# Altium project PCB_Project.PrjPcb
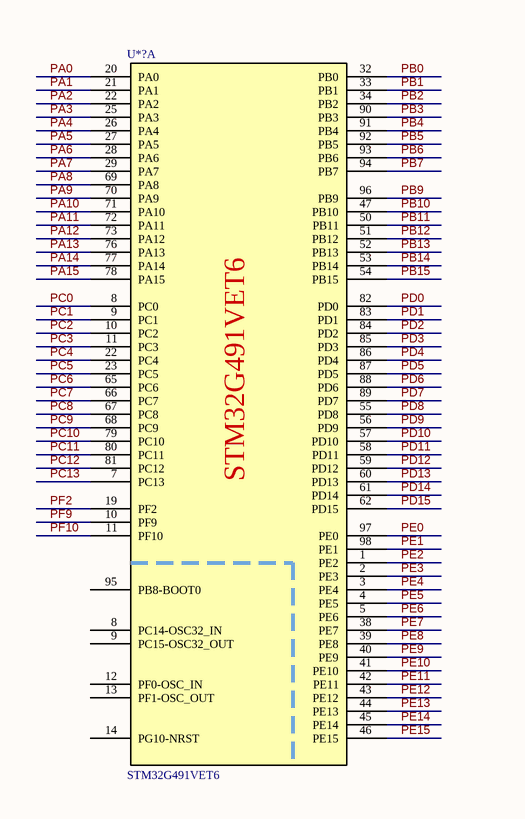
[diagram p0: Sheet1.SchDoc, left]
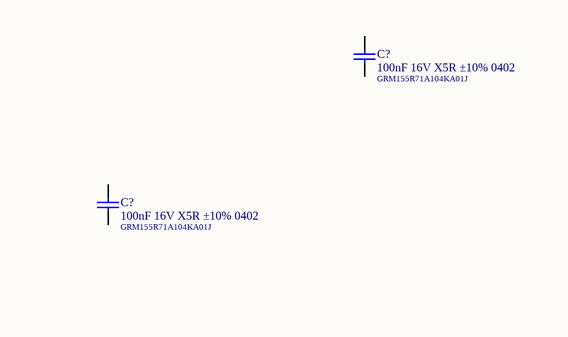
[diagram p1: Sheet1.SchDoc, right]
3 sheets, 15 parts. Net scope: global (net labels, ports and power ports of the same name join across sheets).
Board file: PCB1.PcbDoc
Sheets:
  Sheet1.SchDoc
  Sheet2.SchDoc
  Sheet3.SchDoc

## Sheet Sheet1.SchDoc
size A4; SheetNumber: 1; SheetTotal: 3

### Parts
(Parts that share a designator on the sheet are numbered #1, #2 ... from top to bottom, then left to right.)
C?#1  100nF 16V X5R ±10% 0402  Name: GRM155R71A104KA01J  [0402]
C?#2  100nF 16V X5R ±10% 0402  Name: GRM155R71A104KA01J  [0402]
U*?#1  STM32G491VET6  [QFP50P1600X1600X160-100N]  (part A of 2)

### Nets
PA0: U*?#1.20(PA0)
PA1: U*?#1.21(PA1)
PA2: U*?#1.22(PA2)
PA3: U*?#1.25(PA3)
PA4: U*?#1.26(PA4)
PA5: U*?#1.27(PA5)
PA6: U*?#1.28(PA6)
PA7: U*?#1.29(PA7)
PA8: U*?#1.69(PA8)
PA9: U*?#1.70(PA9)
PA10: U*?#1.71(PA10)
PA11: U*?#1.72(PA11)
PA12: U*?#1.73(PA12)
PA13: U*?#1.76(PA13)
PA14: U*?#1.77(PA14)
PA15: U*?#1.78(PA15)
PB0: U*?#1.32(PB0)
PB1: U*?#1.33(PB1)
PB2: U*?#1.34(PB2)
PB3: U*?#1.90(PB3)
PB4: U*?#1.91(PB4)
PB5: U*?#1.92(PB5)
PB6: U*?#1.93(PB6)
PB7: U*?#1.94(PB7)
PB9: U*?#1.96(PB9)
PB10: U*?#1.47(PB10)
PB11: U*?#1.50(PB11)
PB12: U*?#1.51(PB12)
PB13: U*?#1.52(PB13)
PB14: U*?#1.53(PB14)
PB15: U*?#1.54(PB15)
PC0: U*?#1.8(PC0)
PC1: U*?#1.9(PC1)
PC2: U*?#1.10(PC2)
PC3: U*?#1.11(PC3)
PC4: U*?#1.22(PC4)
PC5: U*?#1.23(PC5)
PC6: U*?#1.65(PC6)
PC7: U*?#1.66(PC7)
PC8: U*?#1.67(PC8)
PC9: U*?#1.68(PC9)
PC10: U*?#1.79(PC10)
PC11: U*?#1.80(PC11)
PC12: U*?#1.81(PC12)
PC13: U*?#1.7(PC13)
PD0: U*?#1.82(PD0)
PD1: U*?#1.83(PD1)
PD2: U*?#1.84(PD2)
PD3: U*?#1.85(PD3)
PD4: U*?#1.86(PD4)
PD5: U*?#1.87(PD5)
PD6: U*?#1.88(PD6)
PD7: U*?#1.89(PD7)
PD8: U*?#1.55(PD8)
PD9: U*?#1.56(PD9)
PD10: U*?#1.57(PD10)
PD11: U*?#1.58(PD11)
PD12: U*?#1.59(PD12)
PD13: U*?#1.60(PD13)
PD14: U*?#1.61(PD14)
PD15: U*?#1.62(PD15)
PE0: U*?#1.97(PE0)
PE1: U*?#1.98(PE1)
PE2: U*?#1.1(PE2)
PE3: U*?#1.2(PE3)
PE4: U*?#1.3(PE4)
PE5: U*?#1.4(PE5)
PE6: U*?#1.5(PE6)
PE7: U*?#1.38(PE7)
PE8: U*?#1.39(PE8)
PE9: U*?#1.40(PE9)
PE10: U*?#1.41(PE10)
PE11: U*?#1.42(PE11)
PE12: U*?#1.43(PE12)
PE13: U*?#1.44(PE13)
PE14: U*?#1.45(PE14)
PE15: U*?#1.46(PE15)
PF2: U*?#1.19(PF2)
PF9: U*?#1.10(PF9)
PF10: U*?#1.11(PF10)

Not connected (* = marked no-connect by the designer): C?#1 1 2; C?#2 1 2; U*?#1 12(PF0-OSC_IN) 13(PF1-OSC_OUT) 14(PG10-NRST) 95(PB8-BOOT0)

### Library data of the parts
C?#1 C?#2 = Capacitor ceramic: Ceramic capacitor; Manufacturer: Murata; Voltage: 16V; Tolerance: ±10%; Capacitance: 100nF; Dielectric: X5R; BOMString: =Capacitance+' '+Voltage+' '+Tolerance+' '+Footprint; HelpURL: *; Supplier: *

## Sheet Sheet2.SchDoc
size A4; SheetNumber: 2; SheetTotal: 3
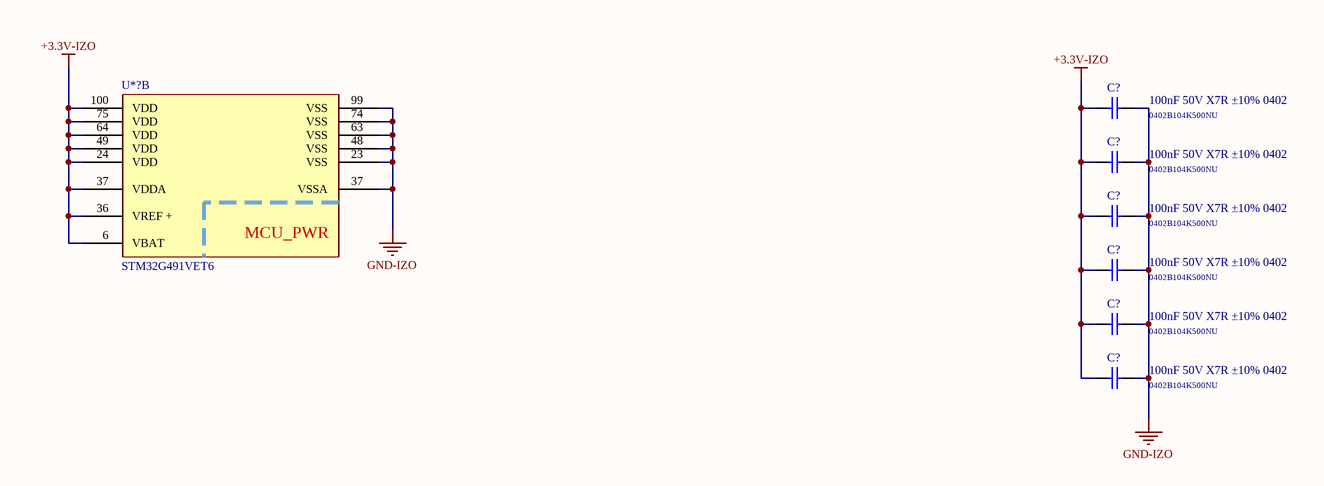
[diagram p2: Sheet2.SchDoc]

### Parts
(Parts that share a designator on the sheet are numbered #1, #2 ... from top to bottom, then left to right.)
C?#3  100nF 50V X7R ±10% 0402  Name: 0402B104K500NU  [0402]
C?#4  100nF 50V X7R ±10% 0402  Name: 0402B104K500NU  [0402]
C?#5  100nF 50V X7R ±10% 0402  Name: 0402B104K500NU  [0402]
C?#6  100nF 50V X7R ±10% 0402  Name: 0402B104K500NU  [0402]
C?#7  100nF 50V X7R ±10% 0402  Name: 0402B104K500NU  [0402]
C?#8  100nF 50V X7R ±10% 0402  Name: 0402B104K500NU  [0402]
U*?#2  STM32G491VET6  [QFP50P1600X1600X160-100N]  (part B of 2)

### Nets
+3.3V-IZO: C?#3.1 C?#4.1 C?#5.1 C?#6.1 C?#7.1 C?#8.1 U*?#2.6(VBAT) U*?#2.24(VDD) U*?#2.36(VREF_+) U*?#2.37(VDDA) U*?#2.49(VDD) U*?#2.64(VDD) U*?#2.75(VDD) U*?#2.100(VDD)
GND-IZO: C?#3.2 C?#4.2 C?#5.2 C?#6.2 C?#7.2 C?#8.2 U*?#2.23(VSS) U*?#2.37(VSSA) U*?#2.48(VSS) U*?#2.63(VSS) U*?#2.74(VSS) U*?#2.99(VSS)

### Notes on the sheet
- (in symbol STM32G491VET6, part B) MCU_PWR

### Library data of the parts
C?#3-C?#8 = Capacitor ceramic: Ceramic capacitor; Manufacturer: Hitano; Voltage: 50V; Tolerance: ±10%; Capacitance: 100nF; Dielectric: X7R; BOMString: =Capacitance+' '+Voltage+' '+Tolerance+' '+Footprint; HelpURL: *; Supplier: *

## Sheet Sheet3.SchDoc
size A4; SheetNumber: 3; SheetTotal: 3
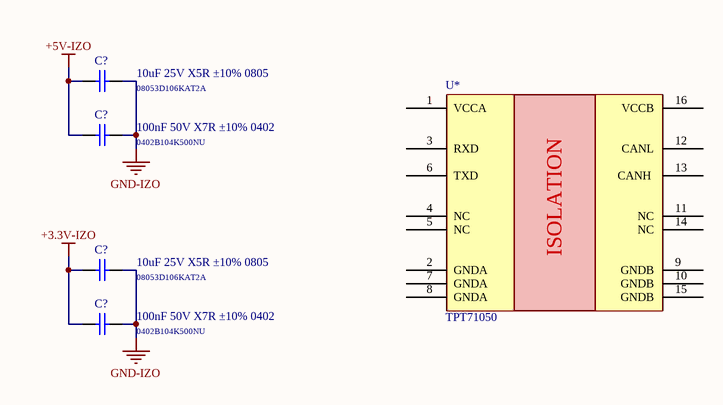
[diagram p3: Sheet3.SchDoc]

### Parts
(Parts that share a designator on the sheet are numbered #1, #2 ... from top to bottom, then left to right.)
C?#9  10uF 25V X5R ±10% 0805  Name: 08053D106KAT2A  [0805]
C?#10  100nF 50V X7R ±10% 0402  Name: 0402B104K500NU  [0402]
C?#11  10uF 25V X5R ±10% 0805  Name: 08053D106KAT2A  [0805]
C?#12  100nF 50V X7R ±10% 0402  Name: 0402B104K500NU  [0402]
U*  TPT71050  [SOIC127P1040X265-16N]

### Nets
+3.3V-IZO: C?#11.1 C?#12.1
+5V-IZO: C?#9.1 C?#10.1
GND-IZO: C?#9.2 C?#10.2 C?#11.2 C?#12.2

Not connected (* = marked no-connect by the designer): U* 1(VCCA) 2(GNDA) 3(RXD) 6(TXD) 7(GNDA) 8(GNDA) 9(GNDB) 10(GNDB) 11(NC) 12(CANL) 13(CANH_) 14(NC) 15(GNDB) 16(VCCB)  4(NC)  5(NC)

### Notes on the sheet
- (in symbol TPT71050) ISOLATION

### Library data of the parts
C?#9 C?#11 = Capacitor ceramic: Ceramic capacitor; Manufacturer: Kyocera; Voltage: 25V; Tolerance: ±10%; Capacitance: 10uF; Dielectric: X5R; BOMString: =Capacitance+' '+Voltage+' '+Tolerance+' '+Footprint; HelpURL: *; Supplier: *
C?#10 C?#12 = Capacitor ceramic: Ceramic capacitor; Manufacturer: Hitano; Voltage: 50V; Tolerance: ±10%; Capacitance: 100nF; Dielectric: X7R; BOMString: =Capacitance+' '+Voltage+' '+Tolerance+' '+Footprint; HelpURL: *; Supplier: *

## Nets that join several sheets
+3.3V-IZO: Sheet2 (14 pins), Sheet3 (C?#11.1 C?#12.1)
GND-IZO: Sheet2 (12 pins), Sheet3 (C?#9.2 C?#10.2 C?#11.2 C?#12.2)